# Altium project RFID_DOOR_LOCK.PrjPcb
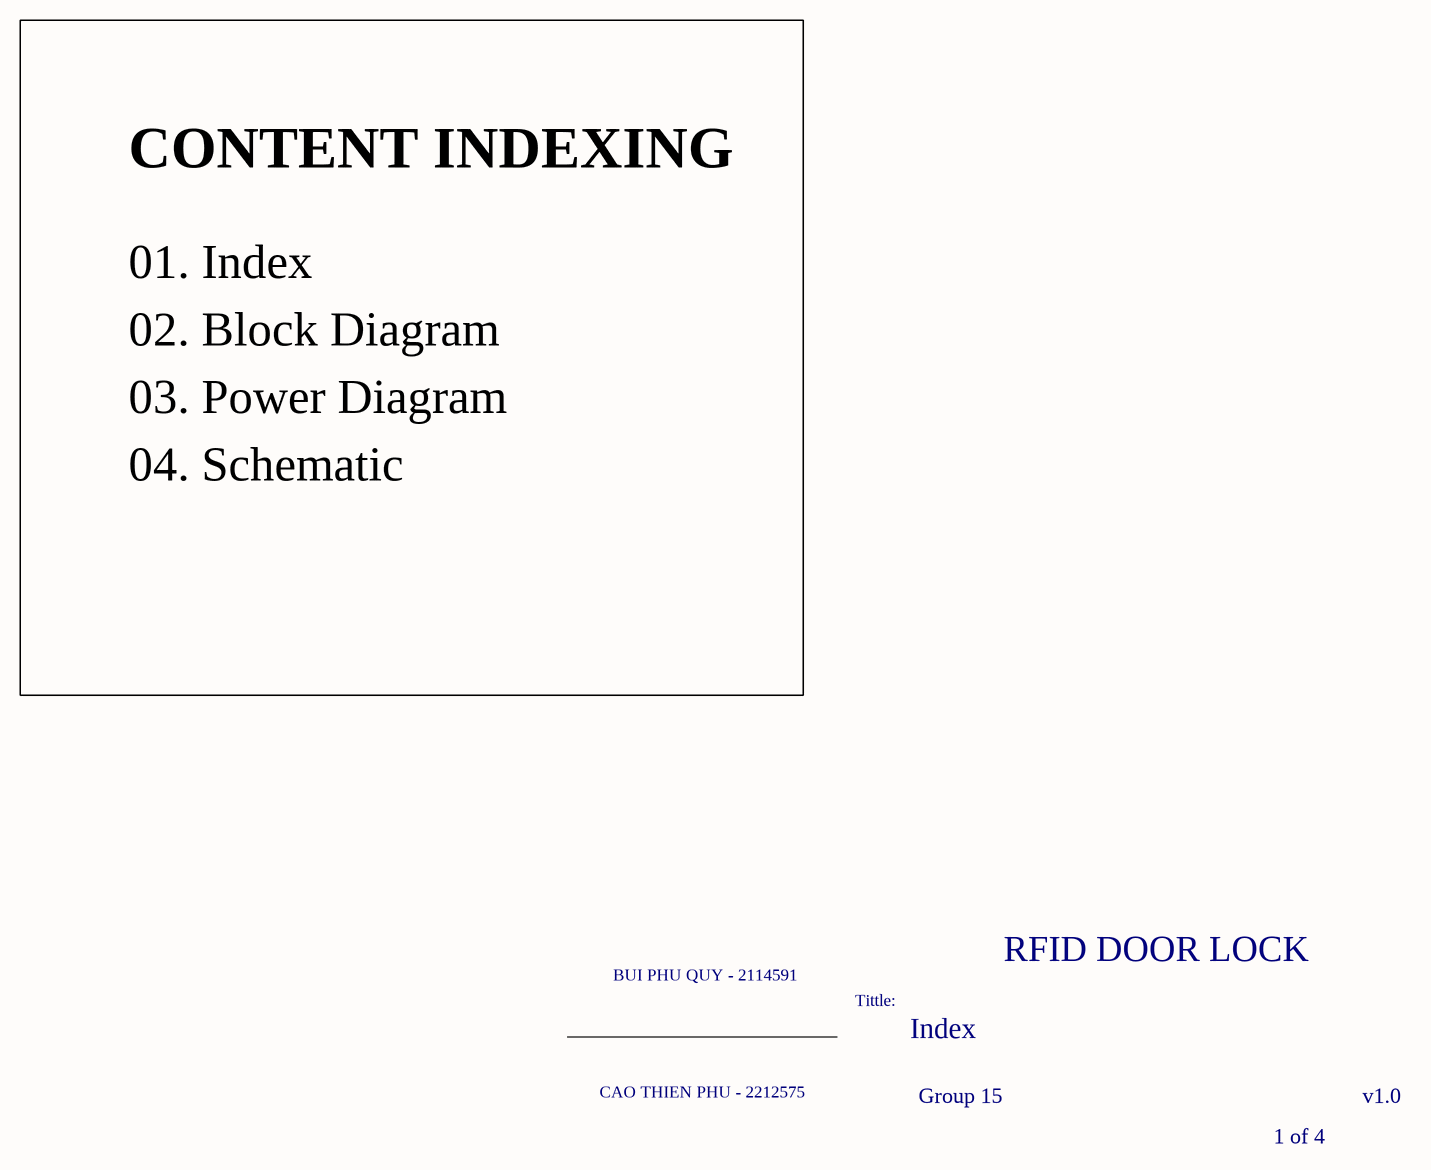
[diagram p0: 01.Index.SchDoc]
4 sheets, 49 parts. Net scope: global (net labels, ports and power ports of the same name join across sheets).
Board file: PCB_RfidDoorLock.PcbDoc
Sheets:
  01.Index.SchDoc
  02.BlockDiagram.SchDoc
  03.PowerDiagram.SchDoc
  04.Schematic.SchDoc

## Sheet 01.Index.SchDoc
size A3; SheetNumber: 1; SheetTotal: 4

### Notes on the sheet
- CONTENT INDEXING
- 01. Index
- 02. Block Diagram
- 03. Power Diagram
- 04. Schematic
- BUI PHU QUY - 2114591
- Tittle:
- RFID DOOR LOCK
- Index
- CAO THIEN PHU - 2212575
- Group 15
- v1.0
- 1 of 4

## Sheet 02.BlockDiagram.SchDoc
size A3; SheetNumber: 2; SheetTotal: 4
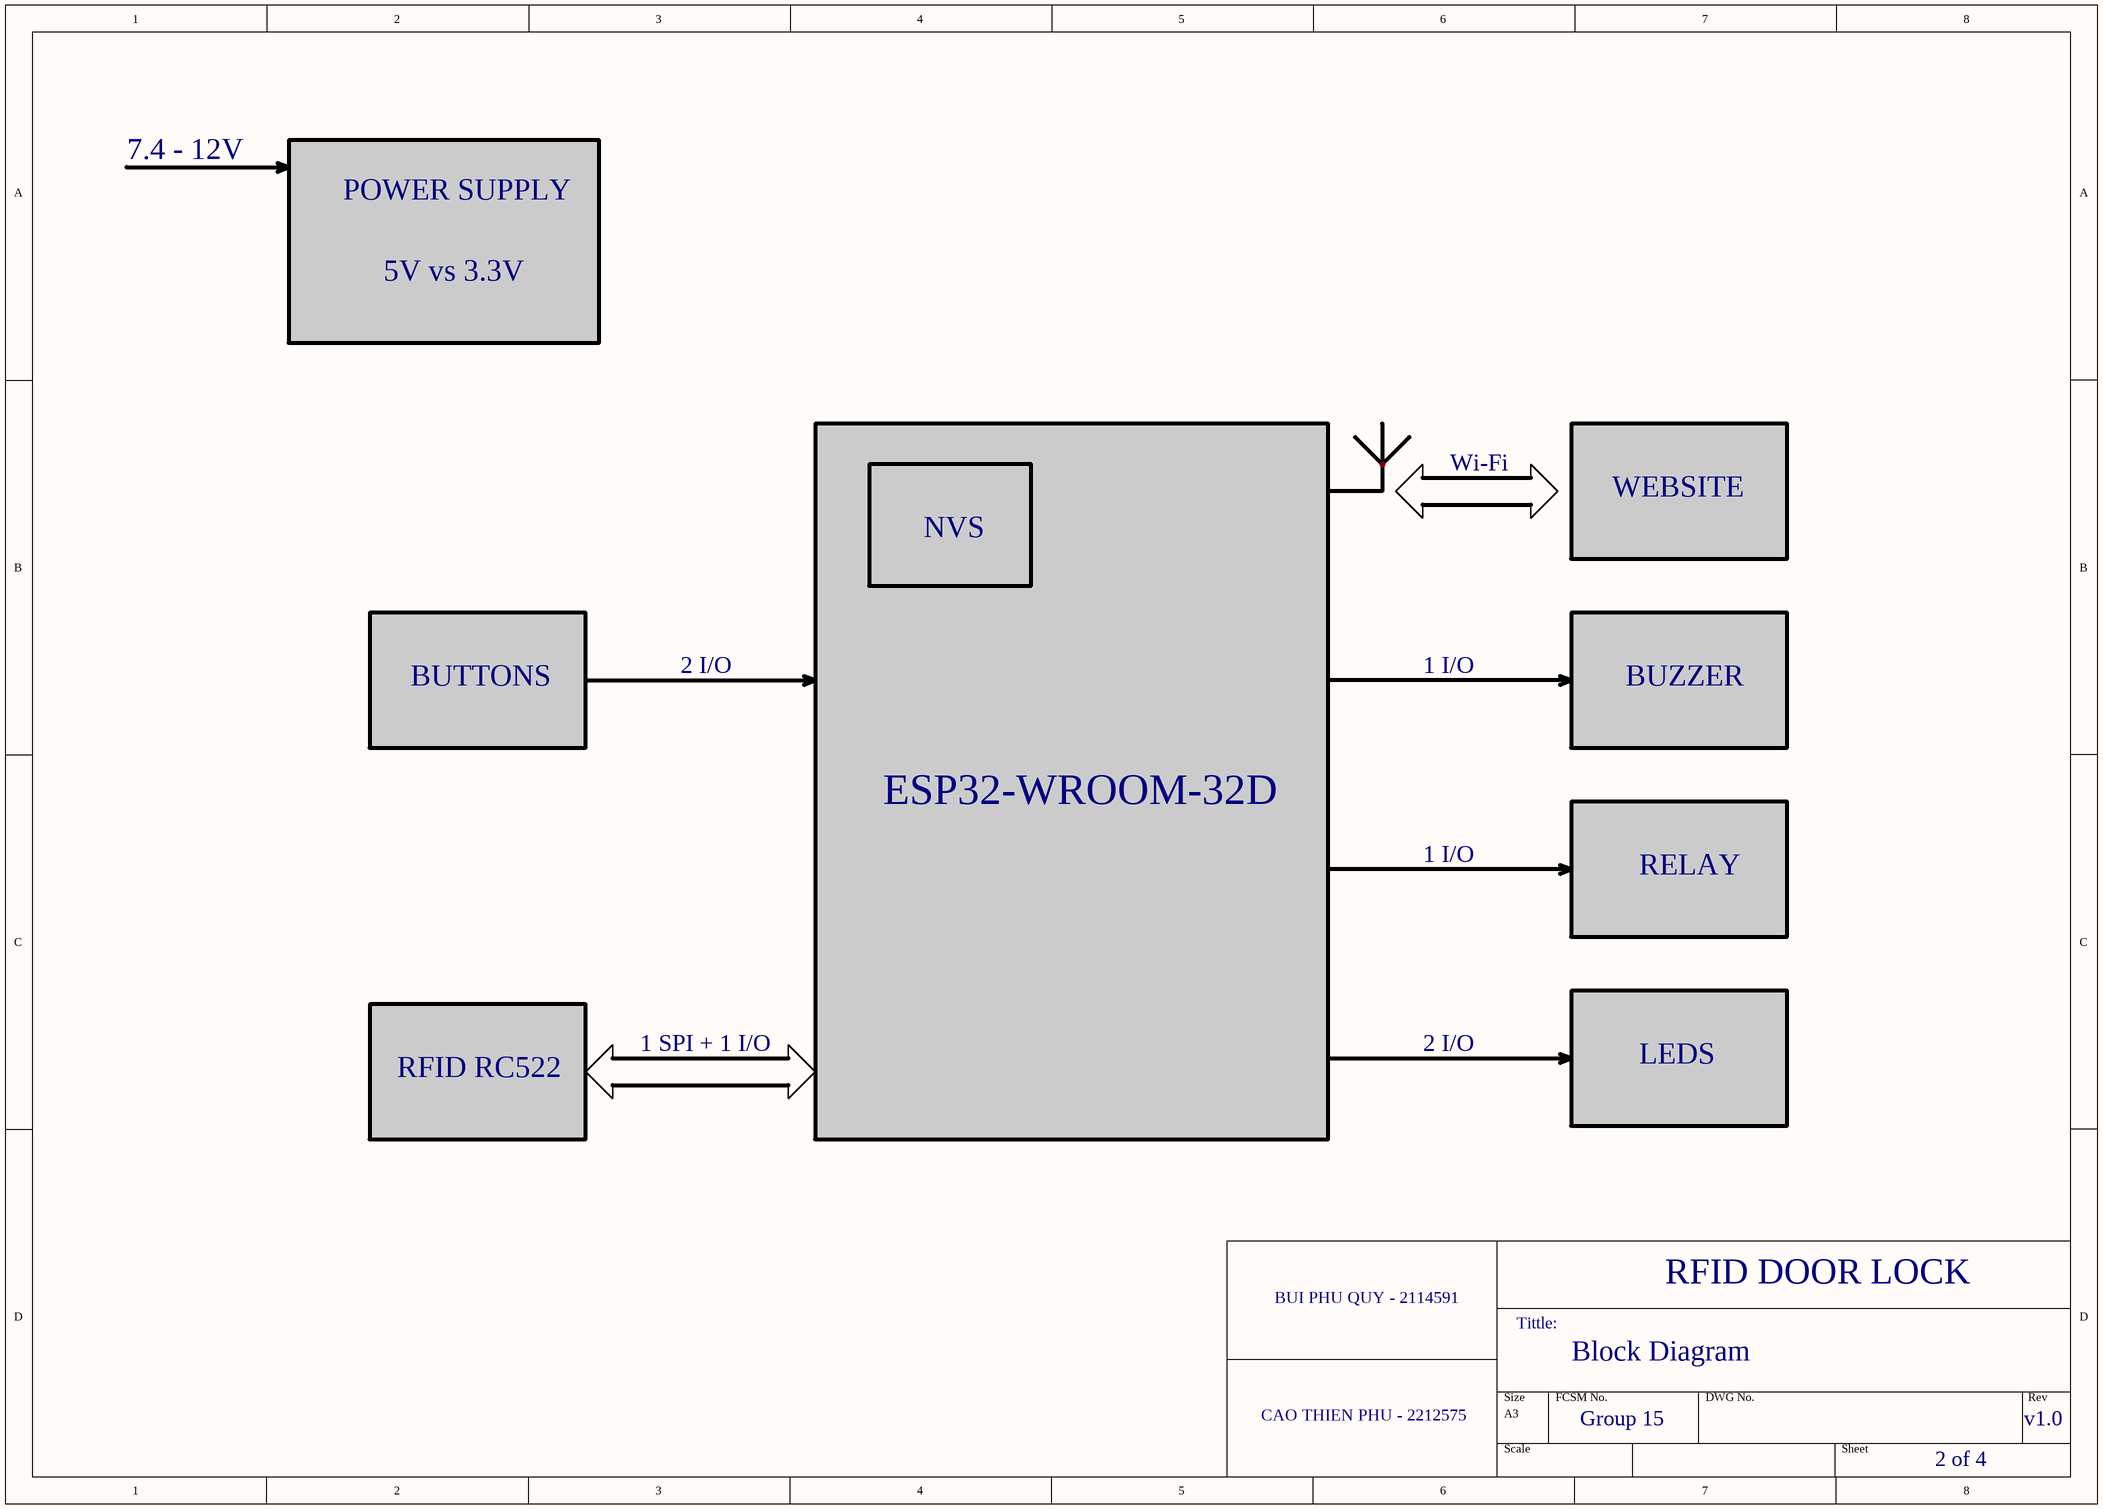
[diagram p1: 02.BlockDiagram.SchDoc]

### Notes on the sheet
- 7.4 - 12V
- POWER SUPPLY
- 5V vs 3.3V
- Wi-Fi
- WEBSITE
- NVS
- BUTTONS
- 2 I/O
- 1 I/O
- BUZZER
- ESP32-WROOM-32D
- RELAY
- 1 SPI + 1 I/O
- RFID RC522
- LEDS
- BUI PHU QUY - 2114591
- Tittle:
- RFID DOOR LOCK
- Block Diagram
- CAO THIEN PHU - 2212575
- Group 15
- v1.0
- 2 of 4

## Sheet 03.PowerDiagram.SchDoc
size A3; SheetNumber: 3; SheetTotal: 4
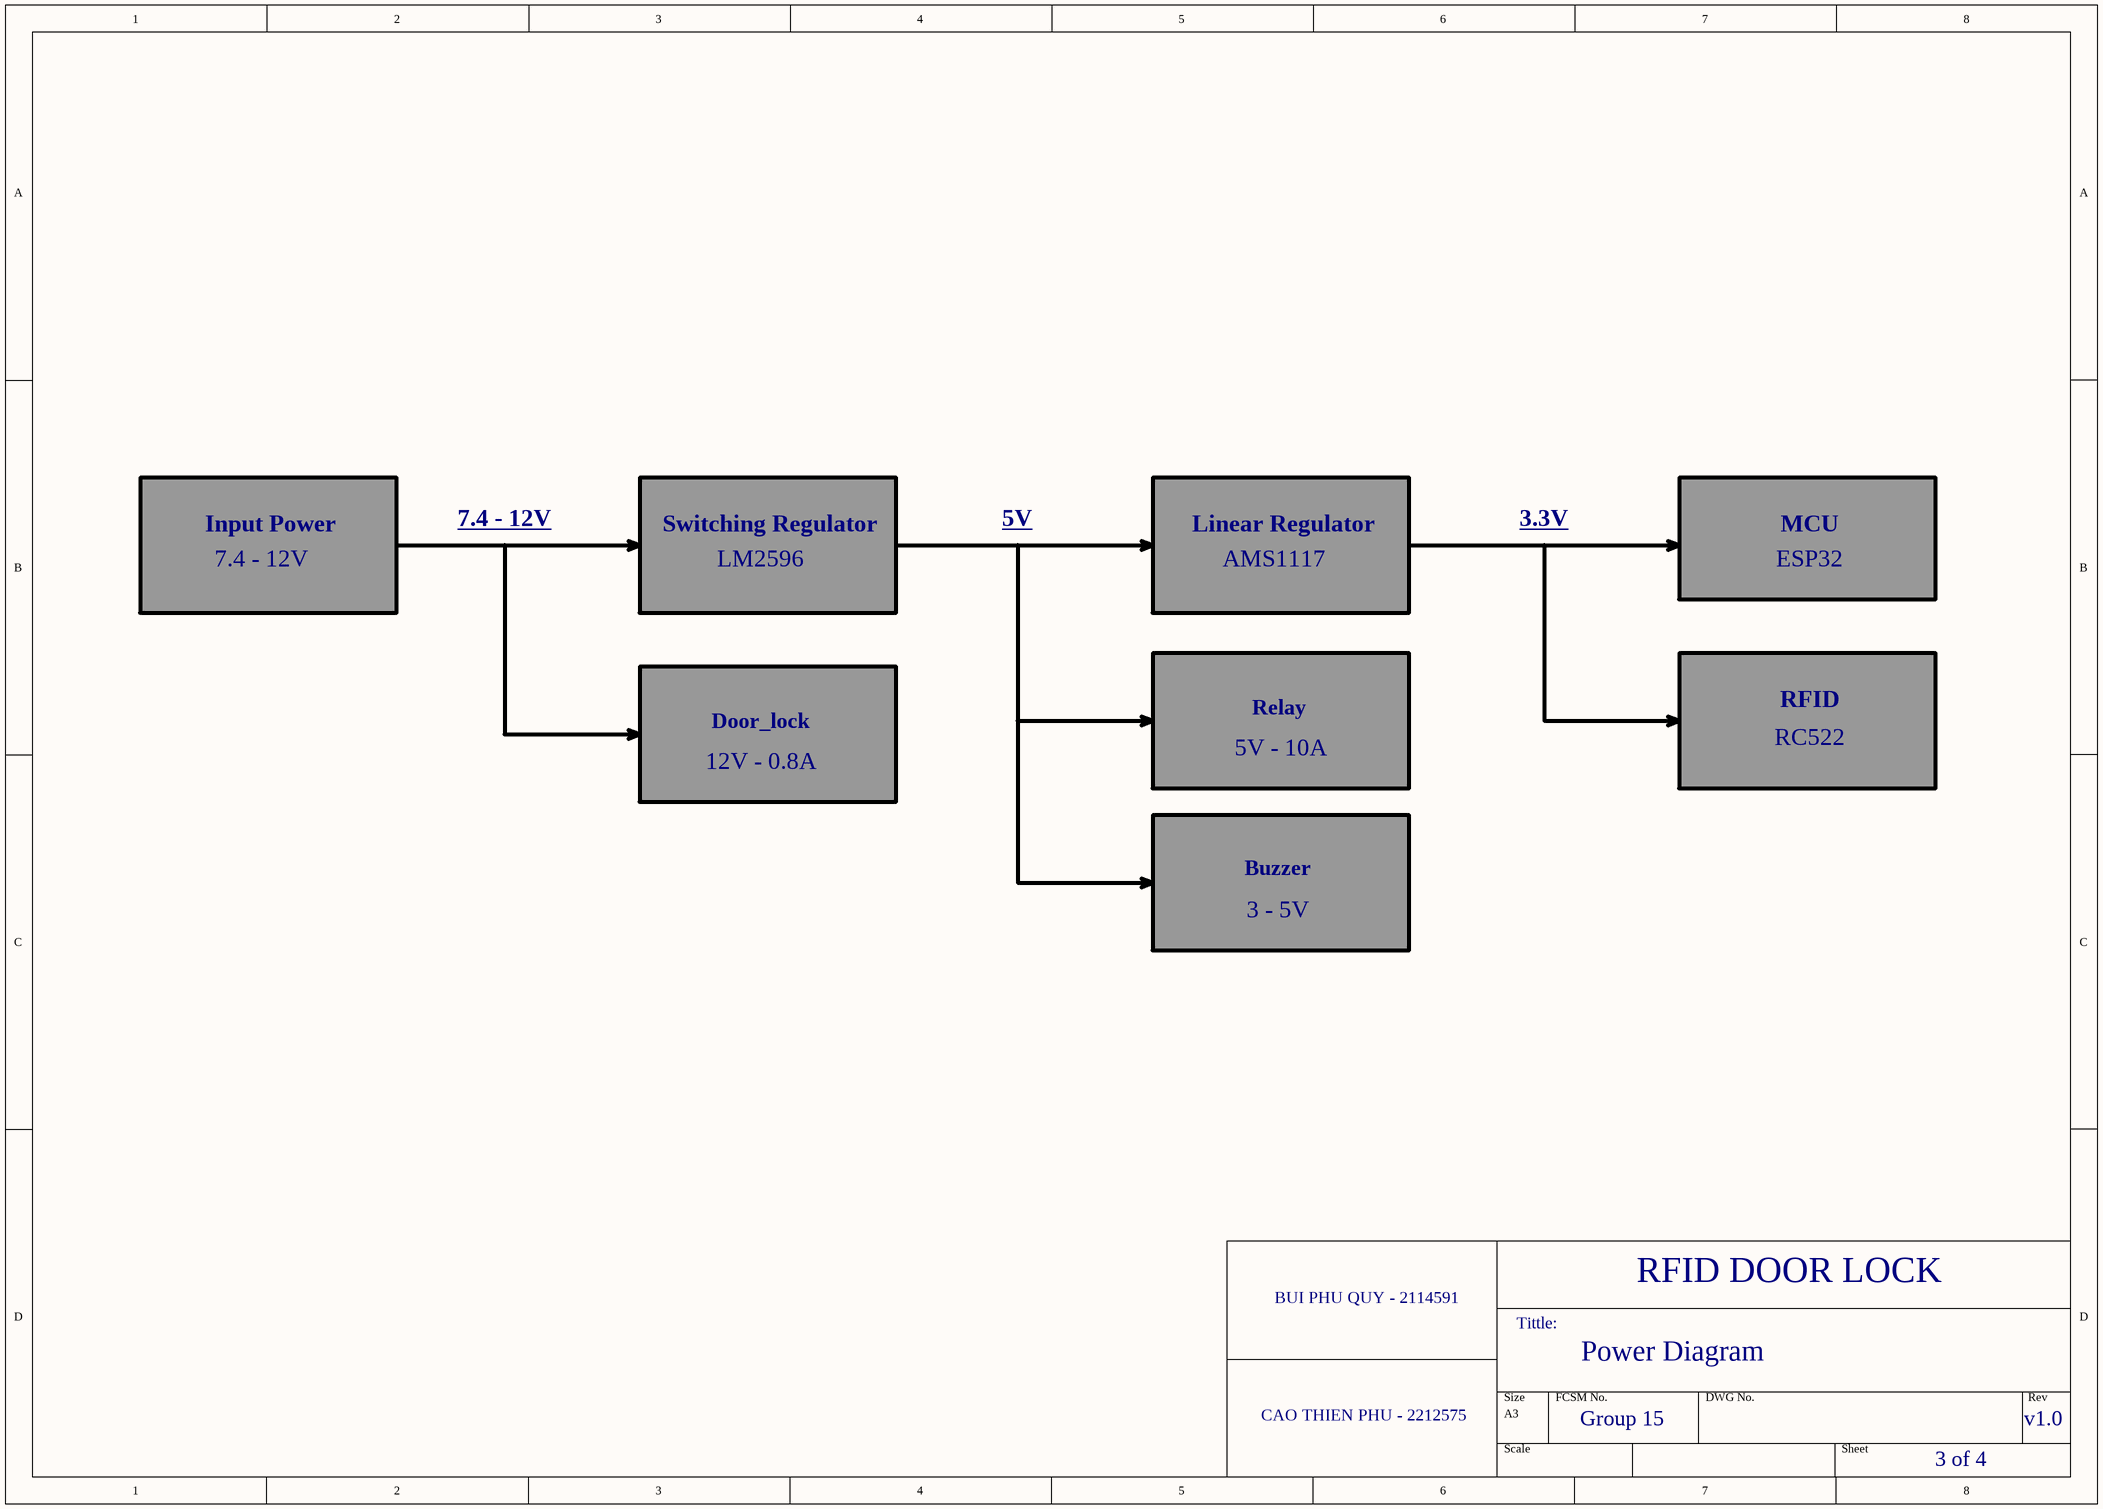
[diagram p2: 03.PowerDiagram.SchDoc]

### Notes on the sheet
- Input Power
- 7.4 - 12V
- Switching Regulator
- 5V
- Linear Regulator
- 3.3V
- MCU
- LM2596
- AMS1117
- ESP32
- Door_lock
- Relay
- RFID
- 12V - 0.8A
- 5V - 10A
- RC522
- Buzzer
- 3 - 5V
- BUI PHU QUY - 2114591
- Tittle:
- RFID DOOR LOCK
- Power Diagram
- CAO THIEN PHU - 2212575
- Group 15
- v1.0
- 3 of 4

## Sheet 04.Schematic.SchDoc
size A3; Engineer: Nhóm 15; SheetNumber: 4; SheetTotal: 4
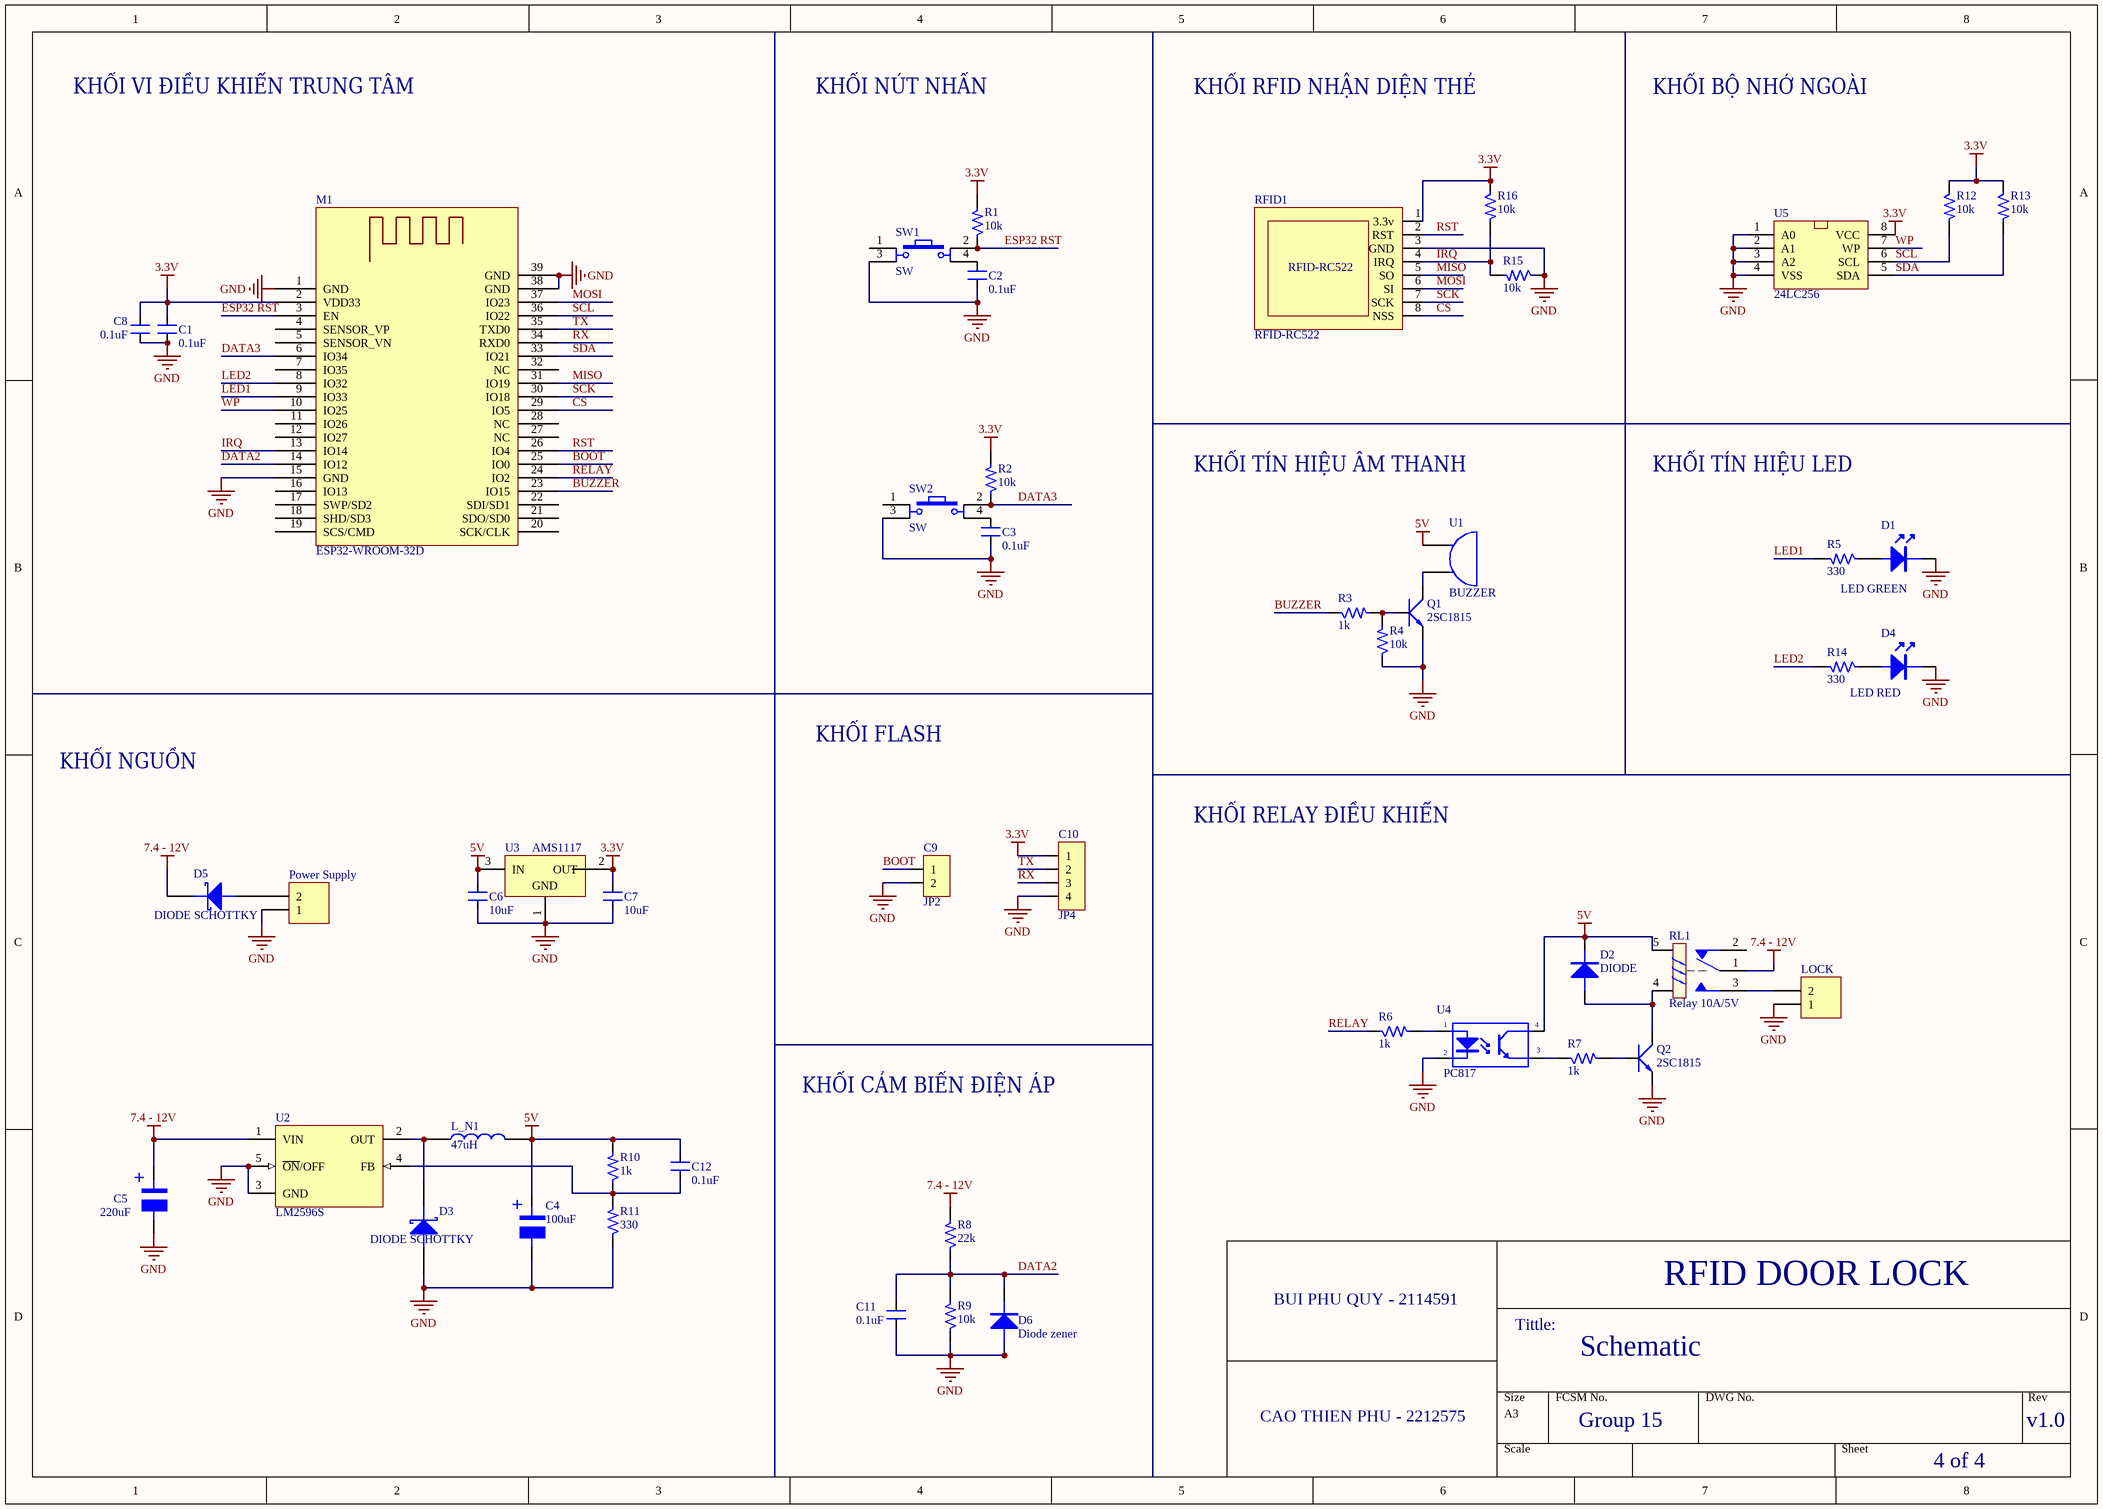
[diagram p3: 04.Schematic.SchDoc]

### Parts
C1  0.1uF  [SMD CAP 0805]
C2  0.1uF  [SMD CAP 0805]
C3  0.1uF  [SMD CAP 0805]
C4  100uF  [100UF/16V_SMD]
C5  220uF  [100UF/16V_SMD]
C6  10uF  [SMD CAP 0805]
C7  10uF  [SMD CAP 0805]
C8  0.1uF  [SMD CAP 0805]
C9  JP2  [JP2-C1T]
C10  JP4  [JP4-C1T]
C11  0.1uF  [SMD CAP 0805]
C12  0.1uF  [SMD CAP 0805]
D1  LED GREEN  [LED3mm]
D2  DIODE  [LL4148 Diode]
D3  DIODE SCHOTTKY  [SMD SS34]
D4  LED RED  [LED3mm]
D5  DIODE SCHOTTKY  [SMD SS34]
D6  Diode zener  [LL4148 Diode]
L_N1  47uH  [SMD 12mmx8mm Inductor]
LOCK  DOMINO  [CON 2]  (value not drawn)
M1  ESP32-WROOM-32D  [ESP32-WROOM-32]
Power_Supply  DOMINO  [CON 2]  (value not drawn)
Q1  2SC1815  [SOT23-321]
Q2  2SC1815  [SOT23-321]
R1  10k  [SM-0805]
R2  10k  [SM-0805]
R3  1k  [SM-0805]
R4  10k  [SM-0805]
R5  330  [SM-0805]
R6  1k  [SM-0805]
R7  1k  [SM-0805]
R8  22k  [SM-0805]
R9  10k  [SM-0805]
R10  1k  [SM-0805]
R11  330  [SM-0805]
R12  10k  [SM-0805]
R13  10k  [SM-0805]
R14  330  [SM-0805]
R15  10k  [SM-0805]
R16  10k  [SM-0805]
RFID1  RFID-RC522  [RFID-RC522-BOARD]
RL1  Relay 10A/5V  [RL_SPDT_10A]
SW1  SW  [SW4]
SW2  SW  [SW4]
U1  BUZZER  [BUZZER 5V]
U2  LM2596S  [TO263-5_Via40/10mil]
U3  AMS1117  [SOT223]
U4  PC817  [DIP4/W0.3]
U5  24LC256  [SOP8_L]

### Nets
3.3V: C1.2 C7.2 C8.2 C10.1 M1.2(VDD33) R1.2 R2.2 R12.1 R13.1 R16.1 RFID1.1(3.3v) U3.2(OUT) U3.4 U5.8(VCC)
5V: C4.1 C6.2 C12.2 D2.2 L_N1.2 R10.2 RL1.5 U1.1(A) U3.3(IN) U4.4(C)
7.4 - 12V: C5.1 D5.2(K) R8.2 RL1.1 U2.1(VIN)
GND: C1.1 C2.1 C3.1 C4.2 C5.2 C6.1 C7.1 C8.1 C9.2 C10.4 C11.1 D1.2 D3.1(A) D4.2 D6.1 LOCK.1 M1.1(GND) M1.15(GND) M1.38(GND) M1.39(GND) Power_Supply.1 Q1.1(E) Q2.1(E) R4.1 R9.1 R11.1 R15.1 RFID1.3(GND) SW1.3 SW2.3 U2.3(GND) U2.5(~{ON}/OFF) U3.1(GND) U4.2(K) U5.1(A0) U5.2(A1) U5.3(A2) U5.4(VSS)
BOOT: C9.1 M1.25(IO0)
BUZZER: M1.23(IO15) R3.1
CS: M1.29(IO5) RFID1.8(NSS)
DATA2: C11.2 D6.2 M1.14(IO12) R8.1 R9.2
DATA3: M1.6(IO34) R2.1 SW2.2
ESP32 RST: M1.3(EN) R1.1 SW1.2
IRQ: M1.13(IO14) R15.2 R16.2 RFID1.4(IRQ)
LED1: M1.9(IO33) R5.2
LED2: M1.8(IO32) R14.2
MISO: M1.31(IO19) RFID1.5(SO)
MOSI: M1.37(IO23) RFID1.6(SI)
RELAY: M1.24(IO2) R6.1
RST: M1.26(IO4) RFID1.2(RST)
RX: C10.3 M1.34(RXD0)
SCK: M1.30(IO18) RFID1.7(SCK)
SCL: M1.36(IO22) R12.2 U5.6(SCL)
SDA: M1.33(IO21) R13.2 U5.5(SDA)
TX: C10.2 M1.35(TXD0)
WP: M1.10(IO25) U5.7(WP)
NetC2_2: C2.2 SW1.4
NetC3_2: C3.2 SW2.4
NetC12_1: C12.1 R10.1 R11.2 U2.4(FB)
NetD1_1: D1.1 R5.1
NetD2_1: D2.1 Q2.2(C) RL1.4
NetD3_2: D3.2(K) L_N1.1 U2.2(OUT)
NetD4_1: D4.1 R14.1
NetD5_1: D5.1(A) Power_Supply.2
NetLOCK_2: LOCK.2 RL1.3
NetQ1_2: Q1.2(C) U1.2(B)
NetQ1_3: Q1.3(B) R3.2 R4.2
NetQ2_3: Q2.3(B) R7.2
NetR6_2: R6.2 U4.1(A)
NetR7_1: R7.1 U4.3(E)

Not connected (* = marked no-connect by the designer): M1 4(SENSOR_VP) 5(SENSOR_VN) 7(IO35) 11(IO26) 12(IO27) 16(IO13) 17(SWP/SD2) 18(SHD/SD3) 19(SCS/CMD) 20(SCK/CLK) 21(SDO/SD0) 22(SDI/SD1) 27(NC) 28(NC) 32(NC); RL1 2; SW1 1; SW2 1

### Notes on the sheet
- KHỐI VI ĐIỀU KHIỂN TRUNG TÂM
- KHỐI NÚT NHẤN
- KHỐI RFID NHẬN DIỆN THẺ
- KHỐI BỘ NHỚ NGOÀI
- KHỐI TÍN HIỆU ÂM THANH
- KHỐI TÍN HIỆU LED
- KHỐI NGUỒN
- KHỐI FLASH
- KHỐI RELAY ĐIỀU KHIỂN
- KHỐI CẢM BIẾN ĐIỆN ÁP
- BUI PHU QUY - 2114591
- RFID DOOR LOCK
- Tittle:
- Schematic
- CAO THIEN PHU - 2212575
- Group 15
- v1.0
- 4 of 4
- (in symbol Cap100uF_SMD) +

### Library data of the parts
C1-C3 C6-C8 C11 C12 = CN4: Cap np W0.4; Value: 0.47uF
C4 = Cap100uF_SMD: Value: 100uF
C5 = Cap100uF_SMD: Value: 100uF
C9 = JP2: WR-PHD 2.54 mm Angled Socket Header; Manufacturer: W¨¹rth Elektronik eiSos GmbH; partNo: 613002143121; ComponentLink1 Description: Manufacturer; ComponentLink2 Description: Datasheet; NoPins: 02; Created Date: 29 March 2013; ComponentLink1URL: http://www.we-online.com; ComponentLink2URL: http://katalog.we-online.de/em/datasheet/6130xx143121.pdf; Created by: Karrer Zheng
C10 = JP4: WR-PHD 2.54 mm Angled Socket Header; Manufacturer: W¨¹rth Elektronik eiSos GmbH; partNo: 613004143121; ComponentLink1 Description: Manufacturer; ComponentLink2 Description: Datasheet; NoPins: 04; Created Date: 29 March 2013; ComponentLink1URL: http://www.we-online.com; ComponentLink2URL: http://katalog.we-online.de/em/datasheet/6130xx143121.pdf; Created by: Karrer Zheng
D1 D4 = LED
D3 D5 = DIODE SCHOTTKY: Schottky Diode
D6 = DIODE
L_N1 = INDUCTOR1
LOCK Power_Supply = HEADER 2
M1 = WIFI_ESP32-WROVER: ESP32; Link: https://www.thegioiic.com/products/esp32-wrover-wifi-bluetooth
Q1 Q2 = 2SC1815: NPN 600mW, ECB; Value: C1815
R1-R16 = Res: Resistor 1/4W; Value: R1/4W - 1K
RFID1 = RFID: ComponentLink1Description: New link; ComponentLink1URL: *
RL1 = Relay 1: Relay SPDT,10A - 12VDC 5 Pin; Value: Relay SPDT, 10A, 12V
SW1 SW2 = SW4: Switch button 4 pin; Value: Button chip 4 pin
U2 = LM2596: SIMPLE SWITCHER; 3A Step-Down Voltage Regulator; PartNumber: LM2596S-5.0; Manufacturer: National Semiconductor; PowerWise: N; FirstPublished: 4-Dec-2008; DatasheetVersion: Aug-2004; PackageVersion: revJ, Jan-1992; PackageReference: T05A; Publisher: Altium Limited; PackageDescription: TO-220, Molded, 5 Lead, Straight; CompType: Switcher; PinCount: 5; DigiKeyPartNumber: LM2576T-5.0-ND; ComponentLink3URL: http://www.national.com/packaging/folders/t05a.html
U3 = AMS117
U4 = PC817_1: Single Opto; Value: PC817
U5 = 24LC256: 256KBit I2C CMOS Serial EEPROM